# Altium schematic sheet CrashDAQSensors.SchDoc
size Letter
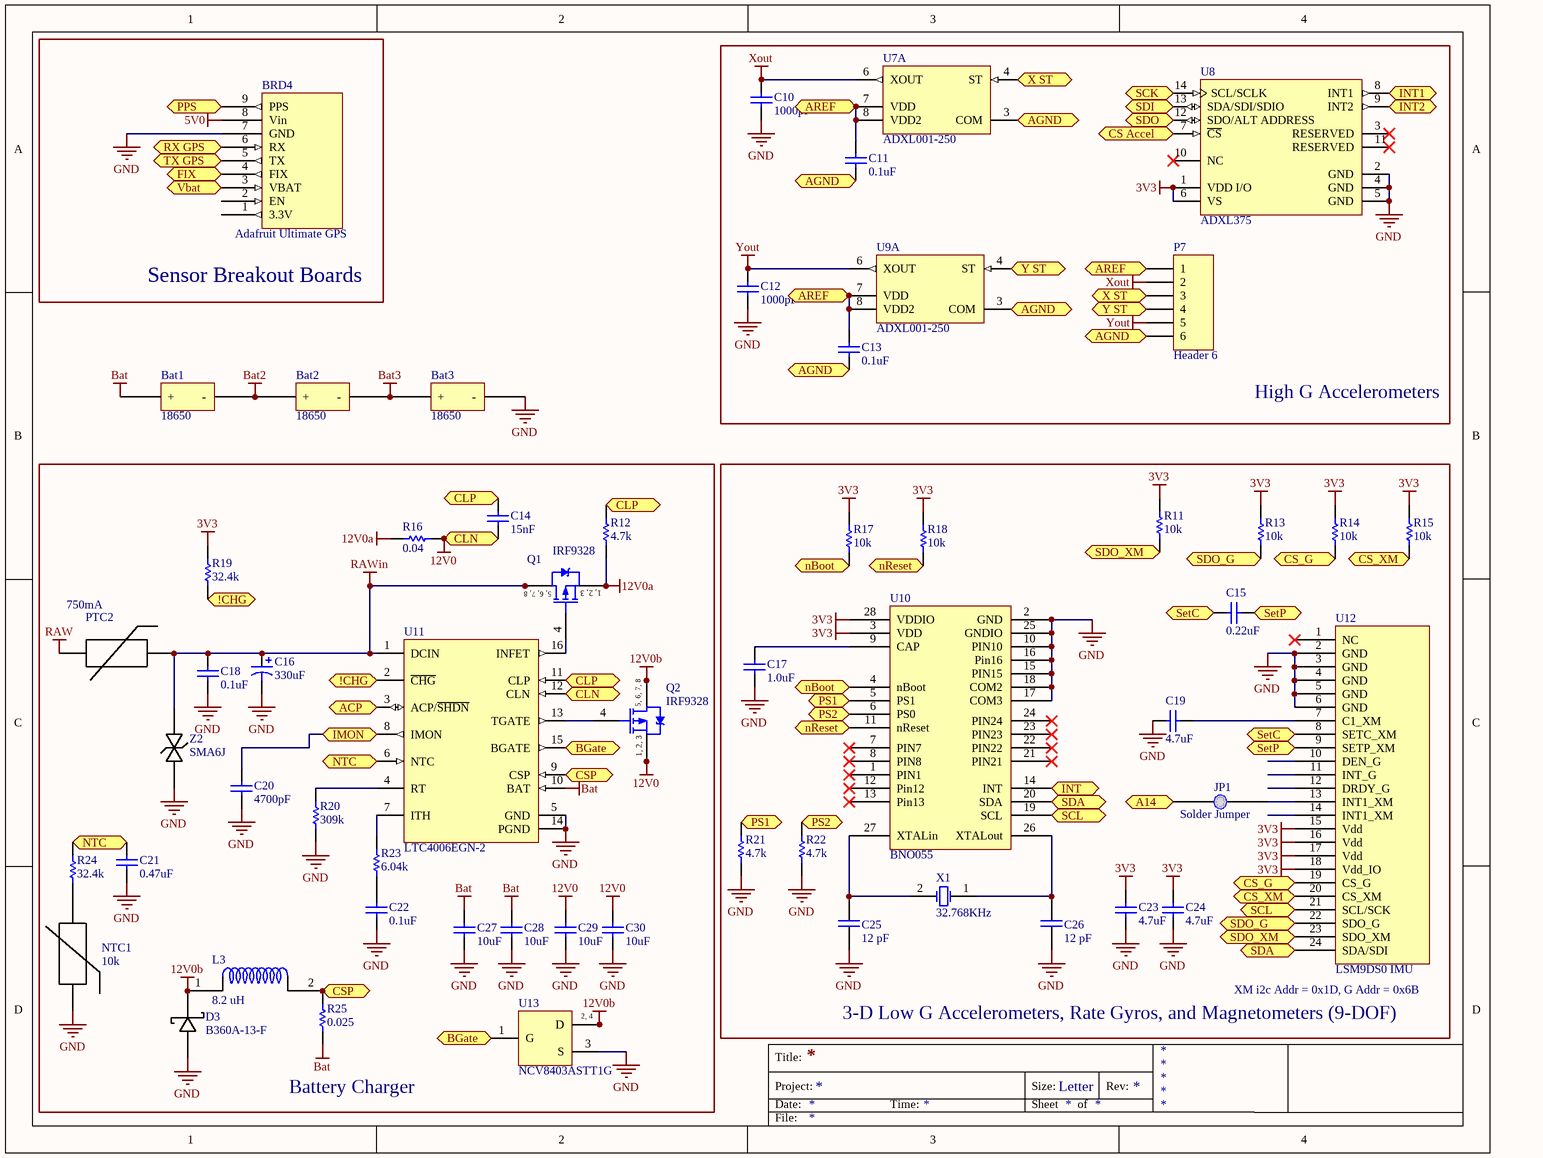
[diagram p0: CrashDAQSensors.SchDoc]

## Parts
Bat1  18650  [18650 Holder]
Bat2  18650  [18650 Holder]
Bat3  18650  [18650 Holder]
BRD4  Adafruit Ultimate GPS  [GPS]
C10  1000pF  [0603]
C11  0.1uF  [0603]
C12  1000pF  [0603]
C13  0.1uF  [0603]
C14  15nF  [0603]
C15  0.22uF  [0603]
C16  330uF  [Elec. Cap 5 x 10mm]
C17  1.0uF  [0603]
C18  0.1uF  [0603]
C19  4.7uF  [1206]
C20  4700pF  [0603]
C21  0.47uF  [0603]
C22  0.1uF  [0603]
C23  4.7uF  [1206]
C24  4.7uF  [1206]
C25  12 pF  [0603]
C26  12 pF  [0603]
C27  10uF  [1206]
C28  10uF  [1206]
C29  10uF  [1206]
C30  10uF  [1206]
D3  B360A-13-F  [SMA with A and K]
JP1  Solder Jumper  [Solder Jumper]
L3  8.2 uH  [Inductor - 1045]
NTC1  10k  [0603]
P7  Header 6  [HDR1X6]
PTC2  750mA  [2920]
Q1  IRF9328  [SOIC-8]
Q2  IRF9328  [SOIC-8]
R11  10k  [0603]
R12  4.7k  [0603]
R13  10k  [0603]
R14  10k  [0603]
R15  10k  [0603]
R16  0.04  [2818]
R17  10k  [0603]
R18  10k  [0603]
R19  32.4k  [0603]
R20  309k  [0603]
R21  4.7k  [0603]
R22  4.7k  [0603]
R23  6.04k  [0603]
R24  32.4k  [0603]
R25  0.025  [2818]
U7  ADXL001-250  [ADI-E-8-1_V]  (part A of 2)
U8  ADXL375  [ADI-CC-14-1_V]
U9  ADXL001-250  [ADI-E-8-1_V]  (part A of 2)
U10  BNO055  [BNO055 LGA]
U11  LTC4006EGN-2  [LT-GN-16_N]
U12  LSM9DS0 IMU  [LGA 4x4x1 mm 24-lead]
U13  NCV8403ASTT1G  [ONSC-SOT-223-4-318E-04_V]
X1  32.768KHz  [XTAL 2 pad]
Z2  SMA6J  [SMA]

## Blocks framed on the sheet
Sensor Breakout Boards: BRD4
High G Accelerometers: C10-C13 P7 U7-U9
Battery Charger: C14 C16 C18 C20-C22 C27-C30 D3 L3 NTC1 PTC2 Q1 Q2 R12 R16 R19 R20 R23-R25 U11 U13 Z2
XM i2c Addr = 0x1D, G Addr = 0x6B: C15 C17 C19 C23-C26 JP1 R11 R13-R15 R17 R18 R21 R22 U10 U12 X1

## Ports
!CHG, A14, ACP, AGND, AREF, BGate, CLN, CLP, CS Accel, CS_G, CS_XM, CSP, FIX, IMON, INT, INT1, INT2, nBoot, nReset, NTC, PPS, PS1, PS2, RX GPS, SCK, SCL, SDA, SDI, SDO, SDO_G, SDO_XM, SetC, SetP, TX GPS, Vbat, X ST, Y ST

## Nets
3V3: C23.2 C24.2 R11.2 R13.2 R14.2 R15.2 R17.2 R18.2 R19.2 U8.1(VDD_I/O) U8.6(VS) U10.3(VDD) U10.28(VDDIO) U12.15(Vdd) U12.16(Vdd) U12.17(Vdd) U12.18(Vdd_IO)
5V0: BRD4.8(Vin)
12V0: C14.1 C29.2 C30.2 Q2.1(S) Q2.2(S) Q2.3(S) R16.2 U11.12(CLN) ; port CLN
12V0a: Q1.1(S) Q1.2(S) Q1.3(S) R12.2 R16.1
12V0b: D3.2(K) L3.1 Q2.5(D) Q2.6(D) Q2.7(D) Q2.8(D) U13.2(D) U13.4(D)
Bat: Bat1.1(+) C27.2 C28.2 R25.2 U11.10(BAT)
Bat2: Bat1.2(-) Bat2.1(+)
Bat3: Bat2.2(-) Bat3.1(+)
GND: Bat3.2(-) BRD4.7(GND) C10.1 C12.1 C16.2 C17.1 C18.1 C19.2 C20.1 C21.1 C22.1 C23.1 C24.1 C25.1 C26.1 C27.1 C28.1 C29.1 C30.1 D3.1(A) NTC1.1 R20.2 R21.1 R22.1 U8.2(GND) U8.4(GND) U8.5(GND) U10.2(GND) U10.10(PIN10) U10.15(PIN15) U10.16(Pin16) U10.17(COM3) U10.18(COM2) U10.25(GNDIO) U11.5(GND) U11.14(PGND) U12.2(GND) U12.3(GND) U12.4(GND) U12.5(GND) U12.6(GND) U13.3(S) Z2.2(K)
RAW: PTC2.1
RAWin: C16.1 C18.2 PTC2.2 Q1.5(D) Q1.6(D) Q1.7(D) Q1.8(D) U11.1(DCIN) Z2.1(A)
Xout: C10.2 P7.2 U7.6(XOUT)
Yout: C12.2 P7.5 U9.6(XOUT)
!CHG: R19.1 U11.2(~{CHG}) ; port !CHG
A14: JP1.1 ; port A14
ACP: U11.3(ACP/~{SHDN}) ; port ACP
AGND: C11.1 C13.1 P7.6 U7.3(COM) U9.3(COM) ; port AGND
AREF: C11.2 C13.2 P7.1 U7.7(VDD) U7.8(VDD2) U9.7(VDD) U9.8(VDD2) ; port AREF
BGate: U11.15(BGATE) U13.1(G) ; port BGate
CLP: C14.2 R12.1 U11.11(CLP) ; port CLP
CS Accel: U8.7(~{CS}) ; port CS Accel
CS_G: R14.1 U12.19(CS_G) ; port CS_G
CS_XM: R15.1 U12.20(CS_XM) ; port CS_XM
CSP: L3.2 R25.1 U11.9(CSP) ; port CSP
FIX: BRD4.4(FIX) ; port FIX
IMON: C20.2 U11.8(IMON) ; port IMON
INT: U10.14(INT) ; port INT
INT1: U8.8(INT1) ; port INT1
INT2: U8.9(INT2) ; port INT2
nBoot: R17.1 U10.4(nBoot) ; port nBoot
nReset: R18.1 U10.11(nReset) ; port nReset
NTC: C21.2 R24.1 U11.6(NTC) ; port NTC
PPS: BRD4.9(PPS) ; port PPS
PS1: R21.2 U10.5(PS1) ; port PS1
PS2: R22.2 U10.6(PS0) ; port PS2
RX GPS: BRD4.6(RX) ; port RX GPS
SCK: U8.14(SCL/SCLK) ; port SCK
SCL: U10.19(SCL) U12.21(SCL/SCK) ; port SCL
SDA: U10.20(SDA) U12.24(SDA/SDI) ; port SDA
SDI: U8.13(SDA/SDI/SDIO) ; port SDI
SDO: U8.12(SDO/ALT_ADDRESS) ; port SDO
SDO_G: R13.1 U12.22(SDO_G) ; port SDO_G
SDO_XM: R11.1 U12.23(SDO_XM) ; port SDO_XM
SetC: C15.2 U12.8(SETC_XM) ; port SetC
SetP: C15.1 U12.9(SETP_XM) ; port SetP
TX GPS: BRD4.5(TX) ; port TX GPS
Vbat: BRD4.3(VBAT) ; port Vbat
X ST: P7.3 U7.4(ST) ; port X ST
Y ST: P7.4 U9.4(ST) ; port Y ST
NetC17_2: C17.2 U10.9(CAP)
NetC19_1: C19.1 U12.7(C1_XM)
NetC22_2: C22.2 R23.2
NetC25_2: C25.2 U10.27(XTALin) X1.2(OSC2)
NetC26_2: C26.2 U10.26(XTALout) X1.1(OSC1)
NetJP1_2: JP1.2 U12.13(INT1_XM)
NetNTC1_2: NTC1.2 R24.2
NetQ1_4: Q1.4(G) U11.16(INFET)
NetQ2_4: Q2.4(G) U11.13(TGATE)
NetR20_1: R20.1 U11.4(RT)
NetR23_1: R23.1 U11.7(ITH)

Not connected (* = marked no-connect by the designer): BRD4 1(3.3V) 2(EN); U8 3(RESERVED)* 10(NC)* 11(RESERVED)*; U10 1(PIN1)* 7(PIN7)* 8(PIN8)* 12(Pin12)* 13(Pin13)* 21(PIN21)* 22(PIN22)* 23(PIN23)* 24(PIN24)*; U12 1(NC)* 10(DEN_G) 11(INT_G) 12(DRDY_G) 14(INT1_XM)

## Notes on the sheet
- 3-D Low G Accelerometers, Rate Gyros, and Magnetometers (9-DOF)
- Title:
- Project:
- Date:
- Time:
- Sheet
- Size:
- Letter
- of
- Rev:
- File:
- (in symbol IRF9328 P-FET) 5, 6, 7, 8; 1, 2, 3
- (in symbol NCV8403ASTT1G) 2, 4

## Library data of the parts
Bat1-Bat3 = Battery: MPD one 18650 LI-ION Cell Holder BK-1850-PC2
BRD4 = GPS - Adafruit
C10 C12 = Cap: 1000pF ±10% 50V X7R Ceramic Capacitor -55°C ~ 125°C Surface Mount, MLCC 0603 (1608 Metric) 0.063" L x 0.031" W (1.60mm x 0.80mm); Manufacturer: Murata Electronics North America; PartNumber: GRM188R71H102KA01D; Supplier 1: Digi-Key; Supplier Part Number 1: 490-1494-1-ND
C11 C13 C18 C22 = Cap: 0.10µF ±10% 50V X7R Ceramic Capacitor -55°C ~ 125°C Surface Mount, MLCC 0603 (1608 Metric) 0.063" L x 0.031" W (1.60mm x 0.80mm); Manufacturer: Murata Electronics North America; PartNumber: GRM188R71H104KA93D; Supplier 1: Digi-Key; Supplier Part Number 1: 490-1519-1-ND
C14 = Cap: CAP CER 0.015UF 50V X7R 0603; Manufacturer: Samsung Electro-Mechanics America, Inc.; PartNumber: CL10B153KB8SFNC; Supplier 1: Digi-Key; Supplier Part Number 1: 1276-1967-1-ND
C15 = Cap: 0.22µF ±10% 25V X7R Ceramic Capacitor -55°C ~ 125°C Surface Mount, MLCC 0603 (1608 Metric) 0.063" L x 0.031" W (1.60mm x 0.80mm); Manufacturer: Murata Electronics North America; PartNumber: GRM188R71E224KA88D; Supplier 1: Digi-Key; Supplier Part Number 1: 490-3290-1-ND
C16 = SMD Elec: CAP ALUM 330UF 20% 50V RADIAL; Manufacturer: Panasonic Electronic Components; PartNumber: ECA-1HM331; Supplier 1: Digi-Key; Supplier Part Number 1: P5184-ND
C17 = Cap: 1µF ±10% 10V X5R Ceramic Capacitor -55°C ~ 85°C Surface Mount, MLCC 0603 (1608 Metric) 0.063" L x 0.031" W (1.60mm x 0.80mm); Manufacturer: Murata Electronics North America; PartNumber: GRM188R61A105KA61D; Supplier 1: Digi-Key; Supplier Part Number 1: 490-1543-1-ND
C19 C23 C24 = Cap: 4.7µF ±10% 50V X7R Ceramic Capacitor -55°C ~ 125°C Surface Mount, MLCC 1206; Manufacturer: Samsung Electro-Mechanics America, Inc.; PartNumber: CL31B475KBHNNNE; Supplier 1: Digi-Key; Supplier Part Number 1: 1276-2789-1-ND
C20 = Cap: Manufacturer: Murata Electronics North America; PartNumber: GRM188R71H472KA01D; Supplier 1: Digi-Key; Supplier Part Number 1: 490-1506-1-ND
C21 = Cap: 0.47µF ±10% 25V X7R Ceramic Capacitor -55°C ~ 125°C Surface Mount, MLCC 0603 (1608 Metric) 0.063" L x 0.031" W (1.60mm x 0.80mm); Manufacturer: Murata Electronics North America; PartNumber: GRM188R71E474KA12D; Supplier 1: Digi-Key; Supplier Part Number 1: 490-3291-1-ND
C25 C26 = Cap: CAP CER 12PF 50V NP0 0603; Manufacturer: Murata Electronics North America; PartNumber: GRM1885C1H120JA01D; Supplier 1: Digi-Key; Supplier Part Number 1: 490-1405-1-ND; Supplier 2: Mouser; Supplier Part Number 2: 81-GRM39C120J50
C27-C30 = Cap: 10µF -20%, +80% 16V Y5V (F) Ceramic Capacitor -30°C ~ 85°C Surface Mount, MLCC 120; Manufacturer: Yageo; PartNumber: CC1206ZKY5V7BB106; Supplier 1: Digi-Key; Supplier Part Number 1: 311-1376-1-ND
D3 = Schottky Diode: DIODE SCHOTTKY 60V 3A SMA; Manufacturer: Diodes Incorporated; Supplier 1: Digi-Key; Supplier Part Number 1: B360A-FDICT-ND; PartNumber: B360A-13-F
L3 = Inductor: FIXED IND 8.2UH 5.05A 28.6 MOHM; Manufacturer: Wurth Electronics Inc; PartNumber: 7447797820; Supplier 1: Digi-Key; Supplier Part Number 1: 732-2213-1-ND
NTC1 = NTC: THERMISTOR 10K OHM NTC 0603 SMD; Manufacturer: Murata Electronics North America; PartNumber: NCP18XH103F03RB; Supplier 1: Digi-Key; Supplier Part Number 1: 490-4800-1-ND
P7 = Header 6: Header, 6-Pin; LatestRevisionDate: 17-Jul-2002; LatestRevisionNote: Re-released for DXP Platform.; Publisher: Altium Limited
PTC2 = PTC: PTC RESETBL 60V 750MA SMD 2920; Manufacturer: Littelfuse; PartNumber: 2920L075/60MR; Supplier 1: Digi-Key; Supplier Part Number 1: F5633CT-ND
Q1 Q2 = IRF9328 P-FET: MOSFET P-CH 30V 12A 8-SOIC; Supplier 1: Digi-Key
R11 R13-R15 R17 R18 = Chip Resistor: 10k Ohm ±1% 0.1W, 1/10W Surface Mount Resistor Thick Film ±100ppm/°C 0603; Manufacturer: Panasonic Electronic Components; PartNumber: ERJ-3EKF1002V; Supplier 1: Digi-Key; Supplier Part Number 1: P10.0KHCT-ND
R12 R21 R22 = Chip Resistor: 4.7k Ohm ±1% 0.1W, 1/10W Surface Mount Resistor Thick Film ±100ppm/°C 0603; Manufacturer: Panasonic Electronic Components; PartNumber: ERJ-3EKF4701V; Supplier 1: Digi-Key; Supplier Part Number 1: P4.70KHCT-ND
R16 = Chip Resistor: 0.04 Ohm ±1% 7W Surface Mount Resistor Metal Element ±75ppm/°C 2818; Manufacturer: Vishay Dale; PartNumber: WSHM2818R0400FEA; Supplier 1: Digi-Key; Supplier Part Number 1: 541-2632-1-ND
R19 R24 = Chip Resistor: 32.4k Ohm ±1% 0.1W, 1/10W Surface Mount Resistor Thick Film ±100ppm/°C 0603; Manufacturer: Panasonic Electronic Components; PartNumber: ERJ-3EKF3242V; Supplier 1: Digi-Key; Supplier Part Number 1: P32.4KHCT-ND
R20 = Chip Resistor: Manufacturer: Panasonic Electronic Components; PartNumber: ERJ-6ENF4701V; Supplier 1: Digi-Key; Supplier Part Number 1: P4.70KCCT-ND
R23 = Chip Resistor: 6.04k Ohm ±1% 0.1W, 1/10W Surface Mount Resistor Thick Film ±100ppm/°C 0603; Manufacturer: Stackpole Electronics Inc.; PartNumber: RMCF0603FT6K04; Supplier 1: Digi-Key; Supplier Part Number 1: RMCF0603FT6K04CT-ND
R25 = Chip Resistor: 0.025 Ohm ±1% 7W Surface Mount Resistor Metal Element ±75ppm/°C 2818; Manufacturer: Vishay Dale; PartNumber: WSHM2818R0250FEA; Supplier 1: Digi-Key; Supplier Part Number 1: 541-2629-1-ND
U7 U9 = AD22279-A: Single-Axis, High-g, iMEMS(R) Accelerometers with Analog Output, 400 Hz BW, Industrial, 8-pin LCC, Reel; Manufacturer: Analog Devices; # of Axes: 1; -3dB Bandwidth: 400 Hz; Automotive Qualified: Yes; Sensitivity: 55 mV/g; Supply Current: 1.3 mA; Voltage Supply (V): 4.75 to 5.25; DatasheetVersion: Rev. B; PackageVersion: 05-21-2010-D, 05/2010; PackageReference: E-8-1; PackageDescription: 8-Pin Ceramic Leadless Chip Carrier, 5 x 5 mm Body, 1.27 mm Pitch; Supplier 1: Digi-Key; Supplier Part Number 1: AD22279-A-ND; Supplier 2: Mouser; Supplier Part Number 2: 584-AD22279-A; Output Type: Analog; Packing: Reel; Mounting Technology: Surface Mount; PartNumber: AD22279-A; ComponentLink1Description: Manufacturer URL; ComponentLink1URL: http://www.analog.com/en/index.html; ComponentLink2Description: Datasheet; ComponentLink2URL: http://www.analog.com/static/imported-files/data_sheets/ADXL78.pdf; ComponentLink3Description: Package Specification; ComponentLink3URL: http:/www.analog.com/static/imported-files/packages/PKG_PDF/LCC(E)/E_8_1.pdf; ComponentLink4Description: Product URL; ComponentLink4URL: http://www.analog.com/en/mems-sensors/mems-inertial-sensors/adxl78/products/product.html
U8 = ADXL343BCCZ: 3-Axis, +/-2 g / +/-4 g / +/-8 g / +/-16 g Digital MEMS Accelerometer with Digital Output, 1.6 KHz BW, Industrial, 14-pin LGA, Tray; Manufacturer: Analog Devices; # of Axes: 3; -3dB Bandwidth: 1.6 KHz; Sensitivity: 256/128/64/32 LSB/g; Voltage Supply (V): 2.0 to 3.6; DatasheetVersion: Rev. 0; PackageVersion: 03-16-2010-A, 03/2010; PackageReference: CC-14-1; PackageDescription: 14-Pin Land Grid Array, 3 x 5 mm Body, 0.8 mm Pitch; Supplier 1: Digi-Key; Supplier Part Number 1: ADXL343BCCZ-ND; Supplier 2: Farnell; Supplier Part Number 2: 2191716; Supplier 3: Newark; Supplier Part Number 3: 90T1358; Supplier 4: Newark; Supplier Part Number 4: 43W5524; Supplier 5: Mouser; Supplier Part Number 5: 584-ADXL343BCCZ; Output Type: Digital; Packing: Tray; Mounting Technology: Surface Mount; PartNumber: ADXL343BCCZ; ComponentLink1Description: Manufacturer URL; ComponentLink1URL: http://www.analog.com/en/index.html; ComponentLink2Description: Datasheet; ComponentLink2URL: http://www.analog.com/static/imported-files/data_sheets/ADXL343.pdf; ComponentLink3Description: Package Specification; ComponentLink3URL: http://www.analog.com/static/imported-files/data_sheets/ADXL343.pdf; ComponentLink4Description: Product URL; ComponentLink4URL: http://www.analog.com/en/mems-sensors/mems-inertial-sensors/adxl343/products/product.html
U10 = BNO055: IMUs - Inertial Measurement Units Absolute Orientation 9-Axis Sensor; Manufacturer: Bosch Sensortec; PartNumber: BNO055; Supplier 1: Mouser; Supplier Part Number 1: 262-BNO055
U11 = LTC4006EGN-2: 4 A, High Efficiency, Standalone Li-Ion Battery Charger, 6 to 28 V Vin, 16-pin SOP (GN-16), -40 to 85 degC; Manufacturer: Linear Technology; Battery Chemistry: Li-Ion, Li-Polymer; Charge Termination: On-board timer; Float Voltage: 12.6 V; Number of Cells: 2 to 4; Type of Charger: Switching; Vin Max(V): 28; Vin Min(V): 6; DatasheetVersion: Rev. A; PackageVersion: Rev. B, 03/2012; PackageReference: GN-16; PackageDescription: 16-Pin Plastic SSOP, Body 4.9 x 3.9 mm, Pitch 0.635 mm; Supplier 1: Digi-Key; Supplier Part Number 1: LTC4006EGN-2-ND; RoHS: FALSE; Mounting Technology: Surface Mount; PartNumber: LTC4006EGN-2; ComponentLink1Description: Manufacturer URL; ComponentLink1URL: http://www.linear.com/; ComponentLink2Description: Datasheet; ComponentLink2URL: http://cds.linear.com/docs/en/datasheet/4006fa.pdf; ComponentLink3Description: Package Specification; ComponentLink3URL: http://cds.linear.com/docs/en/packaging/05081641_B_GN16.pdf
U13 = NCV8403ASTT1G: Self-Protected Low Side Driver with Temperature and Current Limit, 4-Pin SOT-223, Pb-Free, Tape and Reel; Manufacturer: On Semiconductor; Channel Polarity: N Channel; DatasheetVersion: Rev. 5; PackageVersion: Rev. N, 08/2009; PackageReference: SOT-223-4-318E-04; PackageDescription: 4-Pin Small Outline Transistor, Body 6.5 x 3.5 mm, Pitch 2.3 mm; Supplier 1: Digi-Key; Supplier Part Number 1: NCV8403ASTT1G-ND; Supplier 2: Mouser; Supplier Part Number 2: 863-NCV8403ASTT1G; Packing: Tape and Reel; RoHS: Pb-Free; Mounting Technology: Surface Mount; PartNumber: NCV8403ASTT1G; ComponentLink1Description: Manufacturer URL; ComponentLink1URL: http://www.onsemi.com/; ComponentLink2Description: Datasheet; ComponentLink2URL: http://www.onsemi.com/pub_link/Collateral/NCV8403-D.PDF; ComponentLink3Description: Package Specification; ComponentLink3URL: http://www.onsemi.com/pub_link/Collateral/318E-04.PDF
X1 = Crystal Oscillator: Crystal 32.7680kHz 20ppm 12.5pF 70 kOhm -40°C - 85°C Surface Mount 2-SMD; Manufacturer: ECS Inc.; PartNumber: ECS-.327-12.5-39-TR; Supplier 1: Digi-Key; Supplier Part Number 1: XC1658CT-ND; Supplier 2: Mouser; Supplier Part Number 2: 520-.327-12.5-39-TR
Z2 = Zener - Bidirectional: TVS DIODE 15VWM 24.4VC SMA; Manufacturer: STMicroelectronics; PartNumber: P6KE18CA; Supplier 1: Mouser; Supplier Part Number 1: 511-P6KE18CA
JP1 = Solder Jumper: Supplier 1: Digi-Key